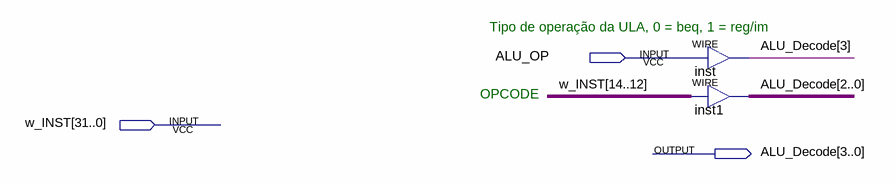
[diagram p0: schematic sheet]
// Quartus schematic ULA_Operador.bdf as structural Verilog: 2 symbols, 3 pins
module ULA_Operador (
  input  ALU_OP,
  input  [31:0] w_INST,
  output [3:0] ALU_Decode
);

  assign ALU_Decode[3] = ALU_OP;  // WIRE inst
  assign ALU_Decode[2:0] = w_INST[14:12];  // WIRE inst1

  // Notes on the sheet:
  //   Tipo de operação da ULA, 0 = beq, 1 = reg/im
  //   OPCODE
endmodule
